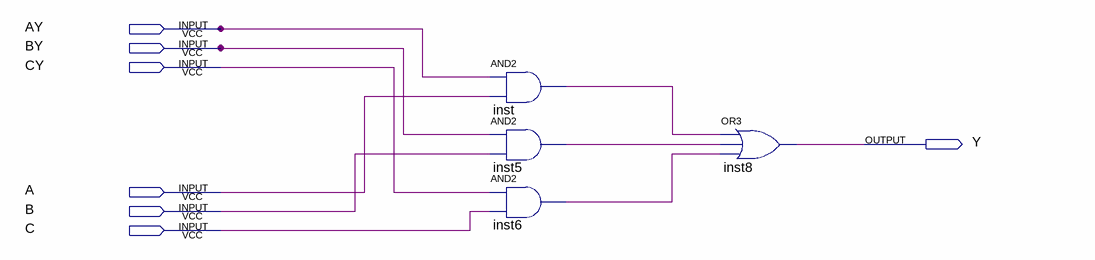
[diagram p0: schematic sheet]
// Quartus schematic x1_3_1.bdf as structural Verilog: 4 symbols, 7 pins
module x1_3_1 (
  input  AY,
  input  BY,
  input  CY,
  input  A,
  input  B,
  input  C,
  output Y
);

  wire inst5_out, inst6_out, inst_out;

  and inst (inst_out, AY, A);
  and inst5 (inst5_out, BY, B);
  and inst6 (inst6_out, CY, C);
  or inst8 (Y, inst_out, inst5_out, inst6_out);
endmodule
